# Altium schematic sheet ST_LINK_V3E.SchDoc: ST_LINK_V3E
size A3; Date: Not used; ApprovedBy: Not used; CheckedBy: Not used; Author: Not used; CompanyName: STMicroelectronics; DrawnBy: Not used; Engineer: Not used; Organization: Not used; Address1: Not used; Address2: Not used; Address3: Not used; Address4: Not used; DocumentNumber: Not used; Revision: Not used; SheetNumber: 10; SheetTotal: 12; CurrentTime: Not used; CurrentDate: Not used; Time: Not used; DocumentFullPathAndName: Not used; DocumentName: Not used; ModifiedDate: Not used; ImagePath: Not used; ProjectName: Not used; Application_BuildNumber: Not used
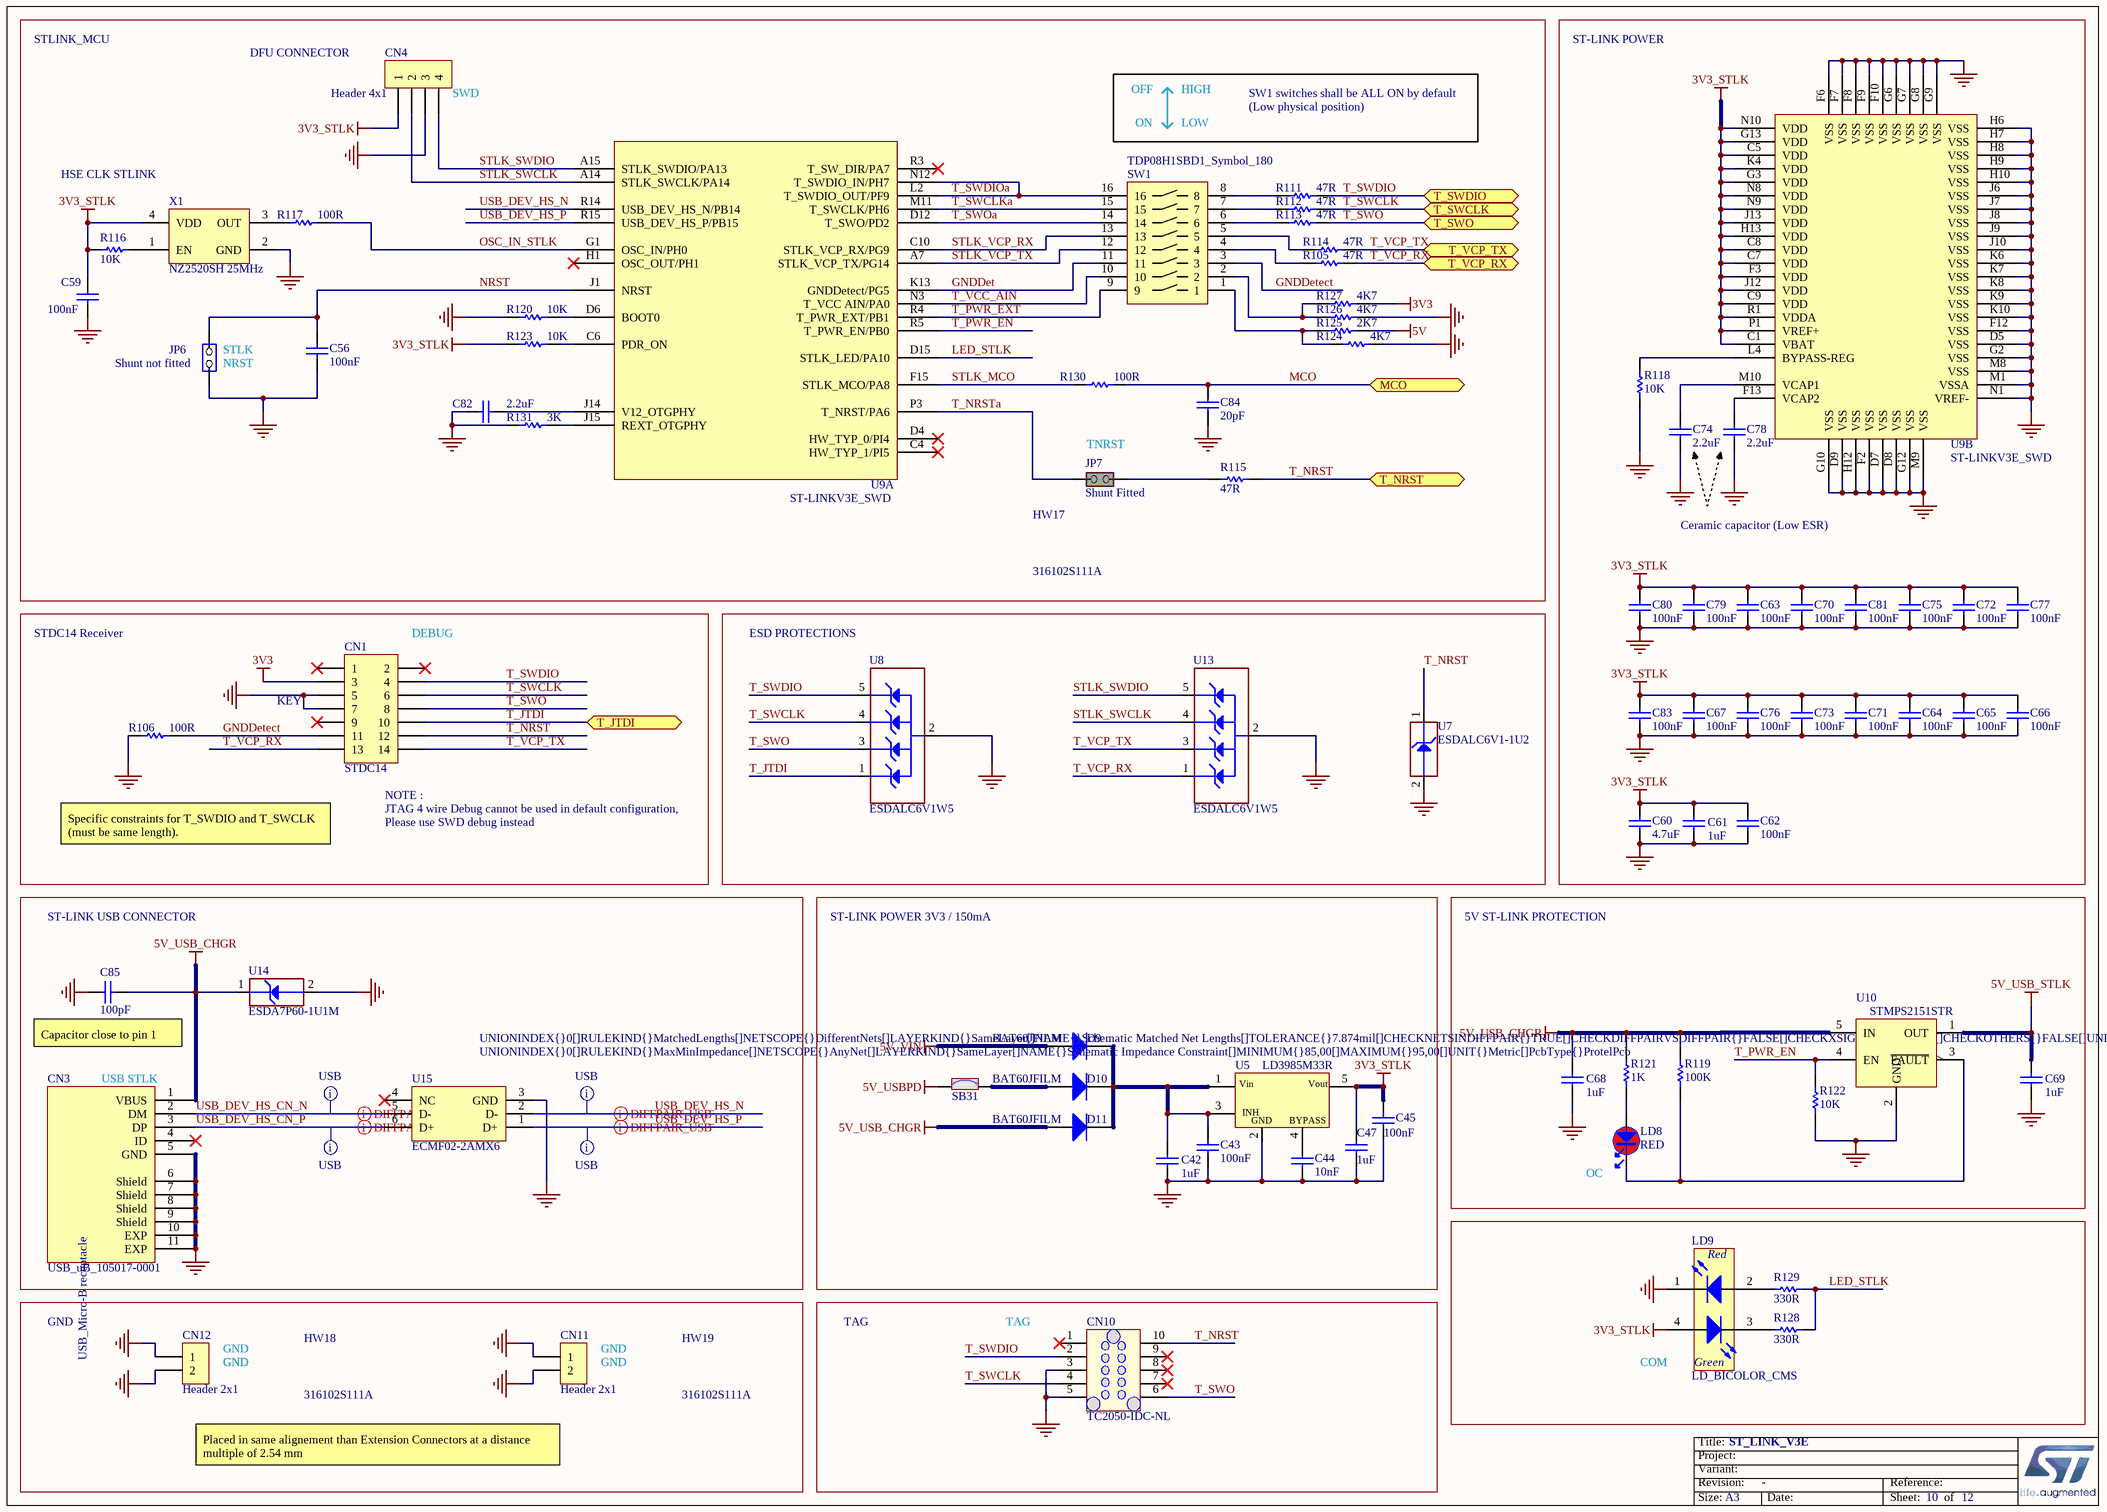
[diagram p0: ST_LINK_V3E.SchDoc]

## Parts
C42  value 1uF  [C0603]
C43  value 100nF  [C0402]
C44  value 10nF  [C0402]
C45  value 100nF  [C0402]
C47  value 1uF  [C0603]
C56  value 100nF  [C0402]
C59  value 100nF  [C0402]
C60  value 4.7uF  [C0603]
C61  value 1uF  [C0603]
C62  value 100nF  [C0402]
C63  value 100nF  [C0402]
C64  value 100nF  [C0402]
C65  value 100nF  [C0402]
C66  value 100nF  [C0402]
C67  value 100nF  [C0402]
C68  value 1uF  [C0603]
C69  value 1uF  [C0603]
C70  value 100nF  [C0402]
C71  value 100nF  [C0402]
C72  value 100nF  [C0402]
C73  value 100nF  [C0402]
C74  value 2.2uF  [C1206_H1P15]
C75  value 100nF  [C0402]
C76  value 100nF  [C0402]
C77  value 100nF  [C0402]
C78  value 2.2uF  [C1206_H1P15]
C79  value 100nF  [C0402]
C80  value 100nF  [C0402]
C81  value 100nF  [C0402]
C82  value 2.2uF  [C0603]
C83  value 100nF  [C0402]
C84  value 20pF  [C0402]
C85  value 100pF  [C0402]
CN1  value STDC14  [CON_STDC14_Receiver_MEDIUM]
CN3  value USB_uB_105017-0001  [CON_USBMICROB_MOLEX_105017-0001_H2P90]
CN4  value Header 4x1  [CON_SAMTEC_TSW-104-07-G-S]
CN10  value TC2050-IDC-NL  [CON_TAG-C_TC2050-IDC-NL]
CN11  Header 2x1  [CON_LYCONN_313102S141346]
CN12  Header 2x1  [CON_LYCONN_313102S141346]
D9  value BAT60JFILM  [DIO_SOD323]
D10  value BAT60JFILM  [DIO_SOD323]
D11  value BAT60JFILM  [DIO_SOD323]
HW17  value 316102S111A  (hidden comment: JUMPER_OPEN)
HW18  value 316102S111A  (hidden comment: JUMPER_OPEN)
HW19  value 316102S111A  (hidden comment: JUMPER_OPEN)
JP6  value Shunt not fitted  [CON_988-JIUBABA_313102S111116]  (hidden comment: Jumper_Header 2x1)
JP7  value Shunt Fitted  [CON_988-JIUBABA_313102S111116]  (hidden comment: Jumper_Header 2x1 Fitted)
LD8  value RED  [LED_0603_RED]
LD9  value LD_BICOLOR_CMS  [LED_BI-GR_HSMF-A201-A00J1]
R105  value 47R  [R0402]
R106  value 100R  [R0402]
R111  value 47R  [R0402]
R112  value 47R  [R0402]
R113  value 47R  [R0402]
R114  value 47R  [R0402]
R115  value 47R  [R0402]
R116  value 10K  [R0402]
R117  value 100R  [R0402]
R118  value 10K  [R0402]
R119  value 100K  [R0603]
R120  value 10K  [R0402]
R121  value 1K  [R0603]
R122  value 10K  [R0603]
R123  value 10K  [R0402]
R124  value 4K7  [R0402]
R125  value 2K7  [R0402]
R126  value 4K7  [R0402]
R127  value 4K7  [R0402]
R128  value 330R  [R0603]
R129  value 330R  [R0603]
R130  value 100R  [R0402]
R131  value 3K  [R0402]
SB31  SB_ON  [SOLDER-BRIDGE_R0603-0R]  (value not drawn)
SW1  value TDP08H1SBD1_Symbol_180  [SWI_C&K_TDP08H1SBD1]  (hidden comment: TDP08H1SBD1_180)
U5  value LD3985M33R  [REG_SOT23-5L]
U7  value ESDALC6V1-1U2  [ESD_ST0201]
U8  value ESDALC6V1W5  [ESD_SOT323-5L]
U9  value ST-LINKV3E_SWD  [ICC_UFBGA201_176+25_10X10_P065]  (parts A,B of 2)
U10  value STMPS2151STR  [MOS_SOT23-5L]
U13  value ESDALC6V1W5  [ESD_SOT323-5L]
U14  value ESDA7P60-1U1M  [ESD_QFN2_1P6X1_P125]
U15  value ECMF02-2AMX6  [ESD_QFN-6L_1P7X1P5_P050]
X1  value NZ2520SH 25MHz  [OSC_NDK_NZ2520SB_4P]  (hidden comment: OSCILLATOR_4_PINS)

## Blocks framed on the sheet
ESD PROTECTIONS: U7 U8 U13
ST-LINK POWER 3V3 / 150mA: C42-C45 C47 D9-D11 SB31 U5
COM: LD9 R128 R129

## Ports
MCO, T_JTDI, T_NRST, T_SWCLK, T_SWDIO, T_SWO, T_VCP_RX, T_VCP_TX

## Nets
3V3: CN1.3 R127.2
3V3_STLK: C45.2 C47.2 C59.2 C60.2 C61.2 C62.2 C63.2 C64.2 C65.2 C66.2 C67.2 C70.2 C71.2 C72.2 C73.2 C75.2 C76.2 C77.2 C79.2 C80.2 C81.2 C83.2 CN4.1 LD9.4(YellowGreen_anode) R116.1 R123.1 U5.5(Vout) U9.C1(VBAT) U9.C5(VDD) U9.C7(VDD) U9.C8(VDD) U9.C9(VDD) U9.F3(VDD) U9.G3(VDD) U9.G13(VDD) U9.H13(VDD) U9.J12(VDD) U9.J13(VDD) U9.K4(VDD) U9.N8(VDD) U9.N9(VDD) U9.N10(VDD) U9.P1(VREF+) U9.R1(VDDA) X1.4(VDD)
5V: R125.1
5V_USB_CHGR: C68.2 C85.2 CN3.1(VBUS) D11.1(A) R119.2 R121.2 U10.5(IN) U14.1(IO1)
5V_USB_STLK: C69.2 U10.1(OUT)
5V_USBPD: SB31.1
5V_VIN: D9.1(A)
GND: C42.1 C43.1 C44.1 C45.1 C47.1 C56.1 C59.1 C60.1 C61.1 C62.1 C63.1 C64.1 C65.1 C66.1 C67.1 C68.1 C69.1 C70.1 C71.1 C72.1 C73.1 C74.1 C75.1 C76.1 C77.1 C78.1 C79.1 C80.1 C81.1 C82.1 C83.1 C84.1 C85.1 CN1.5 CN1.7 CN3.5(GND) CN3.6(Shield) CN3.7(Shield) CN3.8(Shield) CN3.9(Shield) CN3.10(EXP) CN3.11(EXP) CN4.3 CN10.3 CN10.5 CN11.1 CN11.2 CN12.1 CN12.2 JP6.1(COMMON) LD9.1(RED_cathode) R106.1 R118.1 R120.1 R122.2 R124.1 R126.2 R131.1 U5.2(GND) U7.2(GND) U8.2(GND) U9.D5(VSS) U9.D7(VSS) U9.D8(VSS) U9.D9(VSS) U9.F2(VSS) U9.F6(VSS) U9.F7(VSS) U9.F8(VSS) U9.F9(VSS) U9.F10(VSS) U9.F12(VSS) U9.G2(VSS) U9.G6(VSS) U9.G7(VSS) U9.G8(VSS) U9.G9(VSS) U9.G10(VSS) U9.G12(VSS) U9.H6(VSS) U9.H7(VSS) U9.H8(VSS) U9.H9(VSS) U9.H10(VSS) U9.H12(VSS) U9.J6(VSS) U9.J7(VSS) U9.J8(VSS) U9.J9(VSS) U9.J10(VSS) U9.K6(VSS) U9.K7(VSS) U9.K8(VSS) U9.K9(VSS) U9.K10(VSS) U9.M1(VSSA) U9.M8(VSS) U9.M9(VSS) U9.N1(VREF-) U10.2(GND) U13.2(GND) U14.2(GND) U15.3(GND) X1.2(GND)
GNDDet: SW1.11 U9.K13(GNDDetect/PG5)
GNDDetect: CN1.11 R106.2 SW1.3
LED_STLK: R128.2 R129.2 U9.D15(STLK_LED/PA10)
MCO: C84.2 R130.2 ; port MCO
NRST: C56.2 JP6.2(NO) U9.J1(NRST)
OSC_IN_STLK: R117.2 U9.G1(OSC_IN/PH0)
STLK_MCO: R130.1 U9.F15(STLK_MCO/PA8)
STLK_SWCLK: CN4.2 U9.A14(STLK_SWCLK/PA14) U13.4(IO3)
STLK_SWDIO: CN4.4 U9.A15(STLK_SWDIO/PA13) U13.5(IO4)
STLK_VCP_RX: SW1.13 U9.C10(STLK_VCP_RX/PG9)
STLK_VCP_TX: SW1.12 U9.A7(STLK_VCP_TX/PG14)
T_JTDI: CN1.10 U8.1(IO1) ; port T_JTDI
T_NRST: CN1.12 CN10.10 R115.2 U7.1(IO1) ; port T_NRST
T_NRSTa: JP7.1(COMMON) U9.P3(T_NRST/PA6)
T_PWR_EN: R122.1 U9.R5(T_PWR_EN/PB0) U10.4(EN)
T_PWR_EXT: SW1.9 U9.R4(T_PWR_EXT/PB1)
T_SWCLK: CN1.6 CN10.4 R112.2 U8.4(IO3) ; port T_SWCLK
T_SWCLKa: SW1.15 U9.M11(T_SWCLK/PH6)
T_SWDIO: CN1.4 CN10.2 R111.2 U8.5(IO4) ; port T_SWDIO
T_SWDIOa: SW1.16 U9.L2(T_SWDIO_OUT/PF9) U9.N12(T_SWDIO_IN/PH7)
T_SWO: CN1.8 CN10.6 R113.2 U8.3(IO2) ; port T_SWO
T_SWOa: SW1.14 U9.D12(T_SWO/PD2)
T_VCC_AIN: SW1.10 U9.N3(T_VCC_AIN/PA0)
T_VCP_RX: CN1.13 R105.2 U13.1(IO1) ; port T_VCP_RX
T_VCP_TX: CN1.14 R114.2 U13.3(IO2) ; port T_VCP_TX
USB_DEV_HS_CN_N: CN3.2(DM) U15.5(D-)
USB_DEV_HS_CN_P: CN3.3(DP) U15.6(D+)
USB_DEV_HS_N: U9.R14(USB_DEV_HS_N/PB14) U15.2(D-)
USB_DEV_HS_P: U9.R15(USB_DEV_HS_P/PB15) U15.1(D+)
NetC42_2: C42.2 C43.2 D9.2(K) D10.2(K) D11.2(K) U5.1(Vin) U5.3(CE)
NetC44_2: C44.2 U5.4(BYPASS)
NetC74_2: C74.2 U9.M10(VCAP1)
NetC78_2: C78.2 U9.F13(VCAP2)
NetC82_2: C82.2 U9.J14(V12_OTGPHY)
NetD10_1: D10.1(A) SB31.2
NetJP7_2: JP7.2(NO) R115.1
NetLD8_1: LD8.1 R121.1
NetLD8_2: LD8.2 R119.1 U10.3(~{FAULT})
NetLD9_2: LD9.2(Red_anode) R129.1
NetLD9_3: LD9.3(YellowGreen_cathode) R128.1
NetR105_1: R105.1 SW1.4
NetR111_1: R111.1 SW1.8
NetR112_1: R112.1 SW1.7
NetR113_1: R113.1 SW1.6
NetR114_1: R114.1 SW1.5
NetR116_2: R116.2 X1.1(EN)
NetR117_1: R117.1 X1.3(OUT)
NetR118_2: R118.2 U9.L4(BYPASS-REG)
NetR120_2: R120.2 U9.D6(BOOT0)
NetR123_2: R123.2 U9.C6(PDR_ON)
NetR124_2: R124.2 R125.2 SW1.1
NetR126_1: R126.1 R127.1 SW1.2
NetR131_2: R131.2 U9.J15(REXT_OTGPHY)

Not connected (* = marked no-connect by the designer): CN1 1* 2* 9*; CN3 4(ID)*; CN10 1* 7* 8* 9*; U9 C4(HW_TYP_1/PI5)* D4(HW_TYP_0/PI4)* H1(OSC_OUT/PH1)* R3(T_SW_DIR/PA7)*; U15 4(NC)*

## Layout directives
differential pair; rule Impedance Constraint [Min = 85.00    Max = 95.00    ]: USB_DEV_HS_CN_N, USB_DEV_HS_CN_P, USB_DEV_HS_N, USB_DEV_HS_P
rule Undefined; rule Matched Net Lengths [Tolerance = 0.2mm]; rule Impedance Constraint [Min = 85.00    Max = 95.00    ]: USB_DEV_HS_CN_N, USB_DEV_HS_CN_P, USB_DEV_HS_N, USB_DEV_HS_P

## Notes on the sheet
- STLINK_MCU
- ST-LINK POWER
- DFU CONNECTOR
- (near CN4) SWD
- OFF
- HIGH
- SW1 switches shall be ALL ON by default
- (Low physical position)
- HSE CLK STLINK
- ON
- LOW
- (near JP6) STLK
- (near JP6) NRST
- (near JP7) TNRST
- Ceramic capacitor (Low ESR)
- STDC14 Receiver
- (near CN1) DEBUG
- (near CN1) KEY
- Specific constraints for T_SWDIO and T_SWCLK (must be same length).
- JTAG 4 wire Debug cannot be used in default configuration,
- Please use SWD debug instead
- (near CN1) NOTE :
- ST-LINK USB CONNECTOR
- 5V ST-LINK PROTECTION
- (near C85) Capacitor close to pin 1
- (near CN3) USB STLK
- (near LD8) OC
- GND
- TAG
- Placed in same alignement than Extension Connectors at a distance multiple of 2.54 mm
- Title:
- Project:
- Size:
- Revision:
- Variant:
- A3
- -
- Date:
- Reference:
- Sheet:
- of
- (in symbol MCD-00028) USB_Micro-B receptacle
- (in symbol MCD-00051) Red; Green
- (in symbol MCD-00086) INH

## Library data of the parts
C42 C47 C61 C68 C69 = MCD-00010: Capacitor, MLCC, 1uF, 16V, X5R, 10%, 0603, T=0,8mm; Manufacturer_Part_Number: CC0603KRX5R7BB105; Manufacturer: YAGEO; Provided_By: SUBCO; Internal_Part_Number: MCD-00010; Status: Released; Package: C0603; ComponentLink1Description: Datasheet; Part_Type: Capacitor; ComponentLink1URL: http://tunmcdsvn.tun.st.com/Component_Datasheet_Library/Trunk/Capacitors/Yageo_Multilayer_capacitor_X5R_series_100pF_to_100uF
C43 C45 C56 C59 C62-C67 C70-C73 C75-C77 C79-C81 C83 = MCD-00102: Capacitor, MLCC, 100nF, 16V, X7R, 10%, 0402, T=0,5mm; Manufacturer_Part_Number: CC0402KRX7R7BB104; Manufacturer: YAGEO; Alternate_Manufacturer_Part_Number: GCM155R71C104KA55D; Alternate_Manufacturer: MURATA; Provided_By: SUBCO; Internal_Part_Number: MCD-00102; Status: Released; Package: C0402; ComponentLink1Description: Datasheet; Part_Type: Capacitor; ComponentLink1URL: http://tunmcdsvn.tun.st.com/Component_Datasheet_Library/Trunk/Capacitors/Yageo_Multilayer_Capacitor_X7R_series_100pF_to_22uF
C44 = MCD-00011: Capacitor, MLCC, 10nF, 16V, X7R, 10%, 0402, T=0.5mm; Manufacturer_Part_Number: CC0402KRX7R7BB103; Manufacturer: YAGEO; Provided_By: SUBCO; Internal_Part_Number: MCD-00011; Status: Released; Part_Type: Capacitor; Package: C0402; ComponentLink1Description: Datasheet; ComponentLink1URL: http://tunmcdsvn.tun.st.com/Component_Datasheet_Library/Trunk/Capacitors/Yageo_Multilayer_Capacitor_X7R_series_100pF_to_22uF
C60 = MCD-00009: Capacitor, MLCC, 4.7uF, 16V, X5R, 10%, 0603, T=0.8mm; Manufacturer_Part_Number: CC0603KRX5R7BB475; Manufacturer: YAGEO; Provided_By: SUBCO; Internal_Part_Number: MCD-00009; Status: Released; Part_Type: Capacitor; Package: C0603; ComponentLink1Description: Datasheet; ComponentLink1URL: http://tunmcdsvn.tun.st.com/Component_Datasheet_Library/Trunk/Capacitors/Yageo_Multilayer_capacitor_X5R_series_100pF_to_100uF
C74 C78 = MCD-00008: Capacitor, MLCC, 2.2uF, 16V, X7R, 10%, 1206, T=1,15mm; Manufacturer_Part_Number: CC1206KKX7R7BB225; Manufacturer: YAGEO; Alternate_Manufacturer_Part_Number: C1206C225K4RAC; Alternate_Manufacturer: KEMET; Provided_By: SUBCO; Internal_Part_Number: MCD-00008; Status: Released; Package: C1206; ComponentLink1Description: Datasheet; Part_Type: Capacitor; ComponentLink1URL: http://tunmcdsvn.tun.st.com/Component_Datasheet_Library/Trunk/Capacitors/Yageo_Multilayer_Capacitor_X7R_series_100pF_to_22uF
C82 = MCD-00012: Capacitor, MLCC, 2.2uF, 10V, X5R, 10%, 0603, T=0,8mm; Manufacturer_Part_Number: CC0603KRX5R6BB225; Manufacturer: YAGEO; Alternate_Manufacturer_Part_Number: C0603C225K8PACTU; Alternate_Manufacturer: KEMET; Provided_By: SUBCO; Internal_Part_Number: MCD-00012; Status: Released; Package: C0603; ComponentLink1Description: Datasheet; Part_Type: Capacitor; ComponentLink1URL: http://tunmcdsvn.tun.st.com/Component_Datasheet_Library/Trunk/Capacitors/Yageo_Multilayer_capacitor_X5R_series_100pF_to_100uF
C84 = MCD-00016: Capacitor, MLCC, 20pF, 50V, NPO, 5%, 0402, T=0,5mm; Manufacturer_Part_Number: CC0402JRNPO9BN200; Manufacturer: YAGEO; Provided_By: SUBCO; Internal_Part_Number: MCD-00016; Status: Released; Package: C0402; ComponentLink1Description: Datasheet; Part_Type: Capacitor; ComponentLink1URL: http://tunmcdsvn.tun.st.com/Component_Datasheet_Library/Trunk/Capacitors/Yageo_Capacitor_NP0_16V-to-50V
C85 = MCD-00205: Capacitor, MLCC, 100pF, 50V, NPO, 5%, 0402, T=0,5mm; Manufacturer_Part_Number: CC0402JRNPO9BN101; Manufacturer: YAGEO; Provided_By: SUBCO; Internal_Part_Number: MCD-00205; Status: Released; Part_Type: Capacitor; Package: C0402; ComponentLink1Description: Datasheet; ComponentLink1URL: http://tunmcdsvn.tun.st.com/Component_Datasheet_Library/Trunk/Capacitors/Yageo_Capacitor_NP0_16V-to-50V
CN1 = MCD-00592: Header 7x2, 1.27mm, Dual row, Straight, "STDC14_MEDIUM" : footprint compatible with FTSH-107-01-L-DV,-K,-A,-P,-ES (use "STDC14_BIG" to also be compatible with SHF-107-01-L-D-SM,-K); Part_Type: Connector; Manufacturer_Part_Number: FTSH-107-01-L-DV-K; Manufacturer: SAMTEC; Provided_By: SUBCO; Internal_Part_Number: MCD-00592; Status: Released; ComponentLink1Description: Datasheet; ComponentLink1URL: http://tunmcdsvn.tun.st.com/Component_Datasheet_Library/Trunk/Connectors/Samtec_FTSH_smt_series
CN3 = MCD-00028: USB-MICRO-B, 0.65mm, RA, SMT, Bottom Mount,; Manufacturer_Part_Number: 1050170001; Manufacturer: MOLEX; Part_Type: Connector; Provided_By: SUBCO; Internal_Part_Number: MCD-00028; Status: Released; ComponentLink1Description: Datasheet; ComponentLink1URL: http://tunmcdsvn.tun.st.com/Component_Datasheet_Library/Trunk/Connectors/Molex_Connector-USB-microB_105017-0001
CN4 = MCD-00029: Header, 4x1, 2,54mm, VR, TH, Height 5.84mm/2.54mm; Manufacturer_Part_Number: TSW-104-07-x-S; Manufacturer: SAMTEC; Part_Type: Connector; Provided_By: SUBCO; Internal_Part_Number: MCD-00029; Status: Released; ComponentLink1Description: Datasheet; ComponentLink1URL: http://tunmcdsvn.tun.st.com/Component_Datasheet_Library/Trunk/Connectors/Samtec_TSW-HTSW-series
CN10 = MCD-00031: Tag_Connector Header, 10x2, No legs; Manufacturer_Part_Number: TC2050-IDC-NL-FP; Manufacturer: TAG-CONNECT LLC; Provided_By: SUBCO; Internal_Part_Number: MCD-00031; Status: Released; Part_Type: Connector; ComponentLink1Description: Datasheet; ComponentLink1URL: http://tunmcdsvn.tun.st.com/Component_Datasheet_Library/Trunk/Connectors/TAG_Connector_TC2050-IDC-NLFP
CN11 CN12 = MCD-01668: Header 2x1, 2.54mm, VR, TH, height 5.84mm/5.08 mm, height total 13.46 mm; Part_Type: Connector; Manufacturer_Part_Number: 313102S141346; Manufacturer: LYCONN; Provided_By: SUBCO; Internal_Part_Number: MCD-01668; Value: Header 2x1; Status: Footprint available; ComponentLink1Description: Datasheet; ComponentLink1URL: http://tunmcdsvn.tun.st.com/Component_Datasheet_Library/Trunk/Connectors/LYCONN_31XXX_2.54mm_L13.46mm/LYCONN_31XXX_2.54mm_L13.46mm.pdf
D9-D11 = MCD-00034: BAT60JFILM; Manufacturer: STMICROELECTRONICS; Part_Type: Diode; BMS_Part_Number: 9151097; Provided_By: SUBCO with ST control; Internal_Part_Number: MCD-00034; Manufacturer_Part_Number: BAT60JFILM; ComponentLink1Description: Datasheet; Status: Released; ComponentLink1URL: http://tunmcdsvn.tun.st.com/Component_Datasheet_Library/Trunk/Diodes/STM_Diode_BAT60JFILM-SOD323
HW17-HW19 = MCD-01849: Jumper, height 6mm, Black, 2.54mm, 3A, 20 mohm, open; Part_Type: Mechanical; Manufacturer: JIUBABA; Provided_By: SUBCO; Internal_Part_Number: MCD-01849; Status: Footprint available; Manufacturer_Part_Number: 316102S111A; ComponentLink1Description: Datasheet; ComponentLink1URL: http://tunmcdsvn.tun.st.com/Component_Datasheet_Library/Trunk/Mechanical/JIUBABA_316102S111A_Jumper_open_2.54mm/JIUBABA_316102S111A_Jumper_open__2.54mm.pdf; ECCN_US: n/a; ECCN_EU: n/a
JP6 = MCD-01660: Header 2x1, 2.54mm, VR, TH, height 6 mm / 3 mm, total 11.6mm - Shunt not Fitted by default; Part_Type: Connector; Manufacturer_Part_Number: 313102S111116; Manufacturer: JIUBABA; Provided_By: SUBCO; Internal_Part_Number: MCD-01660; Status: Footprint available; ComponentLink1Description: Datasheet; ComponentLink1URL: http://tunmcdsvn.tun.st.com/Component_Datasheet_Library/Trunk/Connectors/JIUBABA_31XXX_2.54mm_L11.6mm/JIUBABA_31XXX_2.54mm_L11.6mm.pdf
JP7 = MCD-01662: Header 2x1, 2.54mm, VR, TH, height 6 mm / 3 mm, total 11.6mm - Shunt Fitted by default; Part_Type: Connector; Manufacturer_Part_Number: 313102S111116; Manufacturer: JIUBABA; Provided_By: SUBCO; Internal_Part_Number: MCD-01662; Status: Footprint available; ComponentLink1Description: Datasheet; ComponentLink1URL: http://tunmcdsvn.tun.st.com/Component_Datasheet_Library/Trunk/Connectors/JIUBABA_31XXX_2.54mm_L11.6mm/JIUBABA_31XXX_2.54mm_L11.6mm.pdf
LD8 = MCD-00049: LED, Red, 0603; Manufacturer_Part_Number: 19-213-R6C-AP1Q2B/3T; Manufacturer: EVERLIGHT; Part_Type: Display; Provided_By: SUBCO; Internal_Part_Number: MCD-00049; ComponentLink1Description: Datasheet; Status: Released; ComponentLink1URL: http://tunmcdsvn.tun.st.com/Component_Datasheet_Library/Trunk/Display/Everlight_SMD-LED-RED_19-213-R6C-AP1Q2B-3T-V3.doc; Package: LED 0603
LD9 = MCD-00051: LED Bicolor; Part_Type: Display; Manufacturer_Part_Number: HSMF-A201-A00J1; Manufacturer: AVAGO TECHNOLOGIES; Alternate_Manufacturer_Part_Number: LE-RGW35280; Alternate_Manufacturer: EVERLUCK; Provided_By: SUBCO; Internal_Part_Number: MCD-00051; Status: Released; ComponentLink1Description: Datasheet; ComponentLink1URL: http://tunmcdsvn.tun.st.com/Component_Datasheet_Library/Trunk/Display/Avago_LED-SMC_HSMx-A2xx-02Feb2012
R105 R111-R115 = MCD-00481: Resistor,47R,0402,1%,1/16W; Manufacturer_Part_Number: RC0402FR-0747RL; Manufacturer: YAGEO; Provided_By: SUBCO; Internal_Part_Number: MCD-00481; Status: Released; Part_Type: Resistor; Package: R0402; ComponentLink1Description: Datasheet; ComponentLink1URL: http://tunmcdsvn.tun.st.com/Component_Datasheet_Library/Trunk/Resistors/Yageo_Resistor_RC0402-series
R106 R117 R130 = MCD-00119: Resistor,100R,0402,1%,1/16W; Manufacturer_Part_Number: RC0402FR-07100RL; Manufacturer: YAGEO; Provided_By: SUBCO; Internal_Part_Number: MCD-00119; Status: Released; Part_Type: Resistor; ComponentLink1Description: Datasheet; Package: R0402; ComponentLink1URL: http://tunmcdsvn.tun.st.com/Component_Datasheet_Library/Trunk/Resistors/Yageo_Resistor_RC0402-series
R116 R118 R120 R123 = MCD-00053: Resistor,10K,0402,1%,1/16W; Manufacturer_Part_Number: RC0402FR-0710KL; Manufacturer: YAGEO; Provided_By: SUBCO; Internal_Part_Number: MCD-00053; Status: Released; ComponentLink1Description: Datasheet; Part_Type: Resistor; Package: R0402; ComponentLink1URL: http://tunmcdsvn.tun.st.com/Component_Datasheet_Library/Trunk/Resistors/Yageo_Resistor_RC0402-series
R119 = MCD-00223: Resistor,100K,0603,1%,1/10W; Manufacturer_Part_Number: RC0603FR-07100KL; Manufacturer: YAGEO; Provided_By: SUBCO; Internal_Part_Number: MCD-00223; Status: Released; Part_Type: Resistor; Package: R0603; ComponentLink1Description: Datasheet; ComponentLink1URL: http://tunmcdsvn.tun.st.com/Component_Datasheet_Library/Trunk/Resistors/Yageo_Resistor_RC0603-series
R121 = MCD-00070: Resistor,1K,0603,1%,1/10W; Manufacturer_Part_Number: RC0603FR-071KL; Manufacturer: YAGEO; Provided_By: SUBCO; Internal_Part_Number: MCD-00070; ComponentLink1Description: Datasheet; Status: Released; Part_Type: Resistor; Package: R0603; ComponentLink1URL: http://tunmcdsvn.tun.st.com/Component_Datasheet_Library/Trunk/Resistors/Yageo_Resistor_RC0603-series
R122 = MCD-00220: Resistor,10K,0603,1%,1/10W; Manufacturer_Part_Number: RC0603FR-0710KL; Manufacturer: YAGEO; Provided_By: SUBCO; Internal_Part_Number: MCD-00220; ComponentLink1Description: Datasheet; Status: Released; Part_Type: Resistor; Package: R0603; ComponentLink1URL: http://tunmcdsvn.tun.st.com/Component_Datasheet_Library/Trunk/Resistors/Yageo_Resistor_RC0603-series
R124 R126 R127 = MCD-00065: Resistor,4K7,0402,1%,1/16W; Manufacturer_Part_Number: RC0402FR-074K7L; Manufacturer: YAGEO; Alternate_Manufacturer_Part_Number: RT0402FRE074K7L; Provided_By: SUBCO; Internal_Part_Number: MCD-00065; Status: Released; ComponentLink1Description: Datasheet; Alternate_Manufacturer: YAGEO; Part_Type: Resistor; Package: R0402; ComponentLink1URL: http://tunmcdsvn.tun.st.com/Component_Datasheet_Library/Trunk/Resistors/Yageo_Resistor_RC0402-series
R125 = MCD-00055: Resistor,2K7,0402,1%,1/16W; Manufacturer_Part_Number: RC0402FR-072K7L; Manufacturer: YAGEO; Provided_By: SUBCO; Internal_Part_Number: MCD-00055; Status: Released; ComponentLink1Description: Datasheet; Part_Type: Resistor; Package: R0402; ComponentLink1URL: http://tunmcdsvn.tun.st.com/Component_Datasheet_Library/Trunk/Resistors/Yageo_Resistor_RC0402-series
R128 R129 = MCD-00197: Resistor,330R,0603,1%,1/10W; Manufacturer_Part_Number: RC0603FR-07330RL; Manufacturer: YAGEO; BMS_Part_Number: 9129729; Provided_By: SUBCO; Internal_Part_Number: MCD-00197; Status: Released; ComponentLink1Description: Datasheet; Part_Type: Resistor; Package: R0603; ComponentLink1URL: http://tunmcdsvn.tun.st.com/Component_Datasheet_Library/Trunk/Resistors/Yageo_Resistor_RC0603-series
R131 = MCD-00185: Resistor,3K,0402,1%,1/16W; Manufacturer_Part_Number: RC0402FR-073KL; Manufacturer: YAGEO; Provided_By: SUBCO; Internal_Part_Number: MCD-00185; Status: Released; ComponentLink1Description: Datasheet; Part_Type: Resistor; Package: R0402; ComponentLink1URL: http://tunmcdsvn.tun.st.com/Component_Datasheet_Library/Trunk/Resistors/Yageo_Resistor_RC0402-series
SB31 = MCD-00071: Solder Bridge ON; Part_Type: Mechanical; Manufacturer_Part_Number: RC0603JR-070RL; Manufacturer: YAGEO; Provided_By: SUBCO; Internal_Part_Number: MCD-00071; Status: Released; Package: SB0603; ComponentLink1Description: Datasheet; ComponentLink1URL: http://tunmcdsvn.tun.st.com/Component_Datasheet_Library/Trunk/Resistors/Yageo_Resistor_RC0603-series; ECCN_US: n/a; ECCN_EU: n/a
SW1 = MCD-01685: 8 positions, Side Actuated DIP switch, 1.27mm, SMT, height 4.1mm, piano type; Part_Type: Misc; Manufacturer: C&K; Provided_By: SUBCO; Internal_Part_Number: MCD-01685; Status: Footprint available; Manufacturer_Part_Number: TDP08H1SBD1; ComponentLink1Description: Datasheet; ComponentLink1URL: http://tunmcdsvn.tun.st.com/Component_Datasheet_Library/Trunk/Misc/C&K_1.27mm_SMT_DIP_Switches_TDP_Series/C&K_1.27mm_SMT_DIP_Switches_TDP_Series.pdf
U5 = MCD-00086: Ultra low drop-low noise BiCMOS voltage, regulators low ESR capacitors compatible; Manufacturer: STMICROELECTRONICS; Part_Type: IC; BMS_Part_Number: 9176161; Provided_By: SUBCO with ST control; Internal_Part_Number: MCD-00086; Status: Released; Manufacturer_Part_Number: LD3985M33R; ComponentLink1Description: Datasheet; ComponentLink1URL: http://tunmcdsvn.tun.st.com/Component_Datasheet_Library/Trunk/IC/STM_LDO_LD3985
U7 = MCD-00170: ESD protection 6V1; Part_Type: Diode; Manufacturer: STMICROELECTRONICS; BMS_Part_Number: 9151132; Provided_By: SUBCO with ST control; Internal_Part_Number: MCD-00170; Status: Released; Manufacturer_Part_Number: ESDALC6V1-1U2; ComponentLink1Description: Datasheet; ComponentLink1URL: http://tunmcdsvn.tun.st.com/Component_Datasheet_Library/Trunk/Diodes/STM_ESD_ESDALC6V1-1U2
U8 U13 = MCD-00136: Dual Transil array for ESD protection; Part_Type: Diode; Manufacturer: STMICROELECTRONICS; BMS_Part_Number: 9151112; Provided_By: SUBCO with ST control; Internal_Part_Number: MCD-00136; Status: Released; Manufacturer_Part_Number: ESDALC6V1W5; ComponentLink1Description: Datasheet; ComponentLink1URL: http://tunmcdsvn.tun.st.com/Component_Datasheet_Library/Trunk/Diodes/STM_ESD_ESDALC6V1W5
U9 = MCD-00596: STM32F723IEK  (STM32F7) BGA176; Part_Type: IC; Manufacturer_Part_Number: STM32F723IEK6; Manufacturer: STMICROELECTRONICS; BMS_Part_Number: 9175300; Provided_By: SUBCO with ST control; Internal_Part_Number: MCD-00596; Status: Released; ComponentLink1Description: Datasheet; ComponentLink1URL: http://tunmcdsvn.tun.st.com/Component_Datasheet_Library/Trunk/IC/BGA176+25L_10x10x0.6_pitch0.65
U10 = MCD-00159: 500mA, Enhanced single channel power switches with active high enable pin; Part_Type: IC; Manufacturer: STMICROELECTRONICS; Alternate_Manufacturer_Part_Number: TPS2051C; Alternate_Manufacturer: TEXAS INSTRUMENTS; BMS_Part_Number: 9159009; Provided_By: SUBCO with ST control; Internal_Part_Number: MCD-00159; Status: Released; Manufacturer_Part_Number: STMPS2151STR; ComponentLink1Description: Datasheet; ComponentLink1URL: http://tunmcdsvn.tun.st.com/Component_Datasheet_Library/Trunk/IC/STM_PWR-Switch_STMPS2151STR
U14 = MCD-00251: High power transient voltage suppressor, 7V breakdown; Part_Type: Diode; Manufacturer: STMICROELECTRONICS; BMS_Part_Number: 9179042; Provided_By: SUBCO with ST control; Internal_Part_Number: MCD-00251; Status: Released; Manufacturer_Part_Number: ESDA7P60-1U1M; ComponentLink1Description: Datasheet; ComponentLink1URL: http://tunmcdsvn.tun.st.com/Component_Datasheet_Library/Trunk/Diodes/STM_ESD_ESDA7P60-1U1M
U15 = MCD-00649: Common mode filter with ESD protection for USB 2.0 interface; Part_Type: Diode; Manufacturer: STMICROELECTRONICS; BMS_Part_Number: 9151138; Provided_By: SUBCO with ST control; Internal_Part_Number: MCD-00649; Status: Released; Manufacturer_Part_Number: ECMF02-2AMX6; ComponentLink1Description: Datasheet; ComponentLink1URL: http://tunmcdsvn.tun.st.com/Component_Datasheet_Library/Trunk/Diodes/STM_ESD_ECMF02-2AMX6
X1 = MCD-00597: Oscillator 25Mhz, +-50ppm, Vcc:3.3V typ, square wave: [0.1Vcc;0.9Vcc], Enable pin, SMD; Part_Type: Crystal_Osc; Manufacturer_Part_Number: NZ2520SH 25MHz END4869C; Manufacturer: NDK; Alternate_Manufacturer_Part_Number: NZ2520SB 25MHz END4869B; BMS_Part_Number: 9157050; Provided_By: SUBCO; Internal_Part_Number: MCD-00597; Status: Released; Alternate_Manufacturer: NDK; ComponentLink1Description: Datasheet; ComponentLink1URL: http://tunmcdsvn.tun.st.com/Component_Datasheet_Library/Trunk/Crystal_Osc/NDK_NZ2520SH 25MHz END4869C